# Altium schematic sheet power.SchDoc
size A4
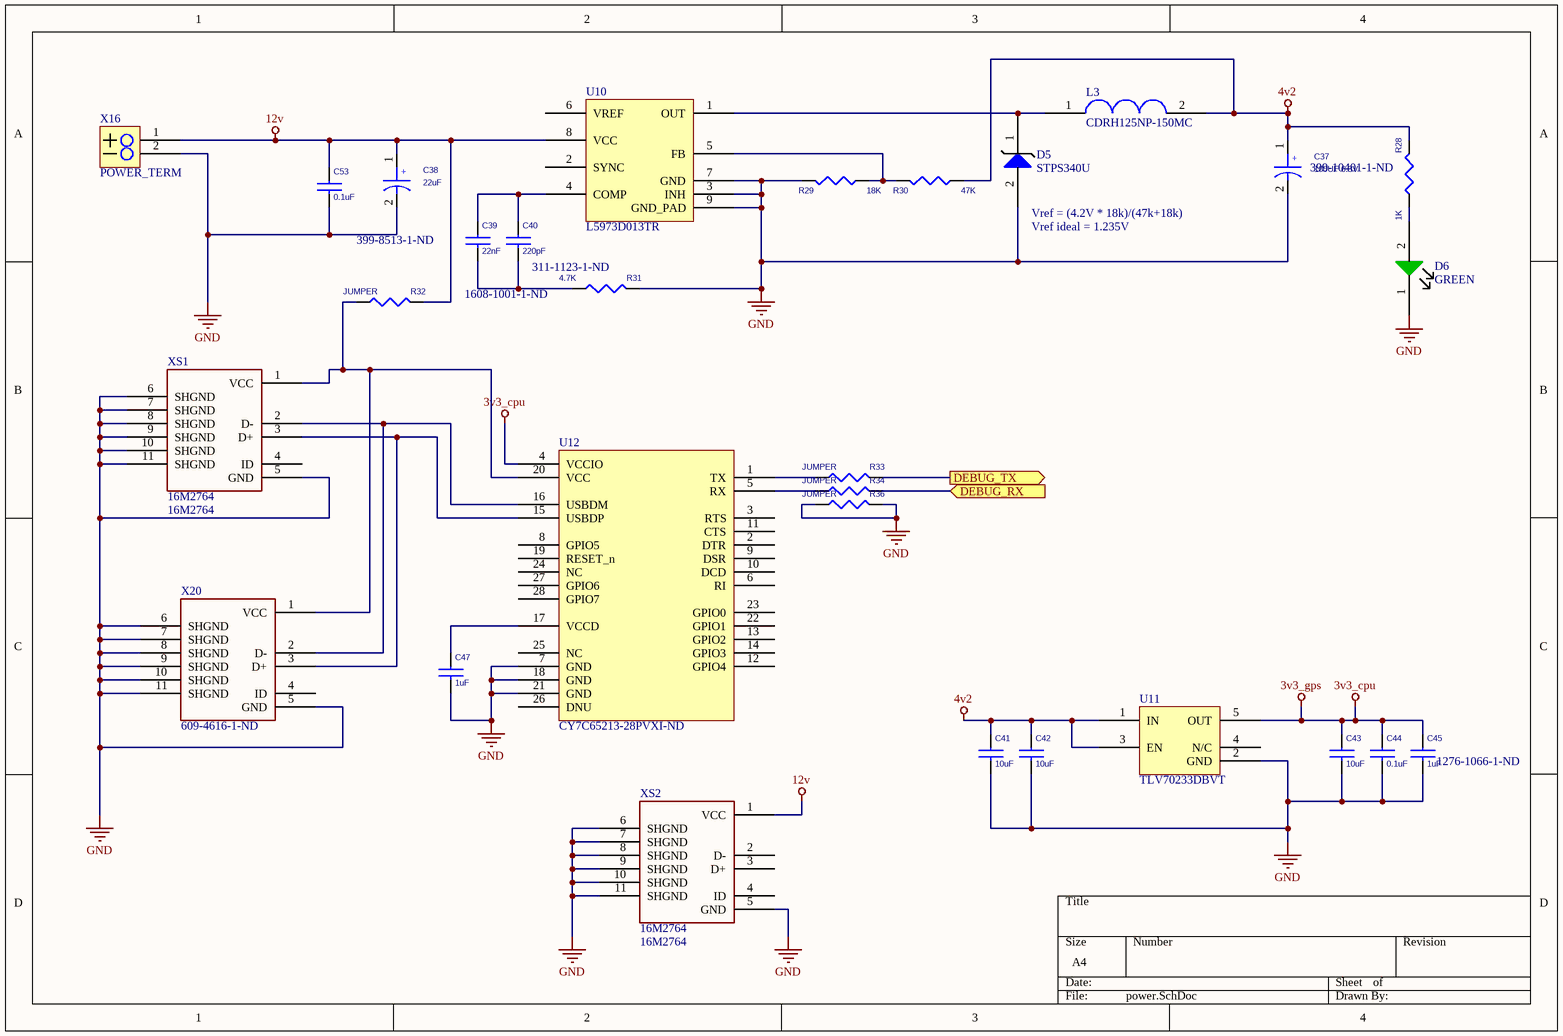
[diagram p0: power.SchDoc]

## Parts
C37  100UF 6.3V  Supplier Part Number 1: 399-10401-1-ND  [CAPMP6133X31N]
C38  22uF  Supplier Part Number 1: 399-8513-1-ND  [CAPMP7143X31N]
C39  22nF  Supplier Part Number 1: 1608-1001-1-ND  [CAPC2012X09M]
C40  220pF  Supplier Part Number 1: 311-1123-1-ND  [CAPC2012X09M]
C41  10uF  [CAPC2012X09M]
C42  10uF  [CAPC2012X09M]
C43  10uF  [CAPC2012X09M]
C44  0.1uF  [CAPC2012X09M]
C45  1uF  Supplier Part Number 1: 1276-1066-1-ND  [CAPC2012X09M]
C47  1uF  [CAPC2012X09M]
C53  0.1uF  [CAPC2012X09M]
D5  STPS340U  [SODFL535X265-2N]
D6  GREEN  [DIOC2012X11N]
L3  CDRH125NP-150MC  [INDP123123X40N_SUMIDA]
R28  1K  [RESC2013X06M]
R29  18K  [RESC2013X06M]
R30  47K  [RESC2013X06M]
R31  4.7K  [RESC2013X06M]
R32  JUMPER  [RESC2013X06M_CMEASURE]
R33  JUMPER  [RESC2013X06M_CMEASURE]
R34  JUMPER  [RESC2013X06M_CMEASURE]
R36  JUMPER  [RESC2013X06M_CMEASURE]
U10  L5973D013TR  [SOIC127P600X175_HS-9N]
U11  TLV70233DBVT  [SOT95P280X145-5M]
U12  Supplier Part Number 1: CY7C65213-28PVXI-ND  [SOP65P780X200-28M]  (hidden comment: CY7C65213)
X16  POWER_TERM  [PH5]
X20  Supplier Part Number 1: 609-4616-1-ND  [USB_MICRO_10118193]  (hidden comment: 10118193-0001LF)
XS1  16M2764  [USB_MINI_16M2764]
XS2  16M2764  [USB_MINI_16M2764]

## Ports
DEBUG_RX (in), DEBUG_TX (out)

## Nets
3v3_cpu: C43.1 C44.1 C45.1 U11.5(OUT) U12.4(VCCIO)  [also labelled 3v3_gps]
4v2: C37.1 C41.1 C42.1 L3.2 R28.2 R30.1 U11.1(IN) U11.3(EN)
12v: C38.1 C53.1 R32.2 U10.8(VCC) X16.1 XS2.1(VCC)
GND: C37.2 C38.2 C41.2 C42.2 C43.2 C44.2 C45.2 C47.2 C53.2 D5.2(A) D6.1(C) R29.2 R31.2 R36.1 R36.2 U10.3(INH) U10.7(GND) U10.9(GND_PAD) U11.2(GND) U12.7(GND) U12.18(GND) U12.21(GND) X16.2 X20.5(GND) X20.6(SHGND) X20.7(SHGND) X20.8(SHGND) X20.9(SHGND) X20.10(SHGND) X20.11(SHGND) XS1.5(GND) XS1.6(SHGND) XS1.7(SHGND) XS1.8(SHGND) XS1.9(SHGND) XS1.10(SHGND) XS1.11(SHGND) XS2.5(GND) XS2.6(SHGND) XS2.7(SHGND) XS2.8(SHGND) XS2.9(SHGND) XS2.10(SHGND) XS2.11(SHGND)
DEBUG_RX: R34.2 ; port DEBUG_RX
DEBUG_TX: R33.2 ; port DEBUG_TX
NetC39_1: C39.1 C40.1 U10.4(COMP)
NetC39_2: C39.2 C40.2 R31.1
NetC47_1: C47.1 U12.17(VCCD)
NetD5_1: D5.1(C) L3.1 U10.1(OUT)
NetD6_2: D6.2(A) R28.1
NetR29_1: R29.1 R30.2 U10.5(FB)
NetR32_1: R32.1 U12.20(VCC) X20.1(VCC) XS1.1(VCC)
NetR33_1: R33.1 U12.1(TX)
NetR34_1: R34.1 U12.5(RX)
NetU12_15: U12.15(USBDP) X20.3(D+) XS1.3(D+)
NetU12_16: U12.16(USBDM) X20.2(D-) XS1.2(D-)

Not connected (* = marked no-connect by the designer): U10 2(SYNC) 6(VREF); U11 4(N/C); U12 2(DTR) 3(RTS) 6(RI) 8(GPIO5) 9(DSR) 10(DCD) 11(CTS) 12(GPIO4) 13(GPIO2) 14(GPIO3) 19(RESET_n) 22(GPIO1) 23(GPIO0) 24(NC) 25(NC) 26(DNU) 27(GPIO6) 28(GPIO7); X20 4(ID); XS1 4(ID); XS2 2(D-) 3(D+) 4(ID)

## Notes on the sheet
- (near D5) Vref = (4.2V * 18k)/(47k+18k)
- Vref ideal = 1.235V
- (in symbol CAP_SMD_22UF_10%) +
- (in symbol CAP_SMD_100UF_10%) +

## Library data of the parts
C37 = CAP_SMD_100UF_10%: CAP 100uF; 6.3V; Case: C; ESR:150mOhm; Supplier 1: Digi-Key
C38 = CAP_SMD_22UF_10%: CAP SMD 35volts 22uF 10% ESR=300mOhms; Supplier 1: Digi-Key
C39 = CAP_SMD_22nF_10%: CAP 22NF 50V 10% X7R 0805; Value: 22nF; Supplier 1: Digi-Key
C40 = CAP_SMD_220pF_10%: CAP 220PF 50V 10%  0805; Value: 220pF; Supplier 1: Digi-Key
C41-C43 = CAP_SMD_10UF_20%: CAP CER 10UF 16V 20% X5R 0805; Value: 10uF; Supplier 1: Digi-Key; Supplier Part Number 1: 399-8013-1-ND
C44 C53 = CAP_SMD_0.1UF_10%: CAP CER 0.1UF 25V 10% X7R 0805; Value: 0.1uF; Supplier 1: Digi-Key; Supplier Part Number 1: 399-1168-6-ND
C45 C47 = CAP_SMD_1uF_10%: MLCC; 1uF; 25V; X7R; ±10%; SMD; 0805;; Value: 1uF; Supplier 1: Digi-Key
  C47: Supplier Part Number 1: 1276-1066-1-ND
D5 = STPS340U: DIODE, ZENER, 20V, 3W; Supplier 1: Digi-Key; Supplier Part Number 1: 497-13432-1-ND
D6 = LED_GREEN: Supplier 1: Digi-Key; Supplier Part Number 1: 160-1179-2-ND
L3 = IND_15uH_3.3A: Supplier 1: Digi-Key; Supplier Part Number 1: 308-1440-1-ND
R28 = RES_SMD_1K_5%: RES - 1K OHM, 5%, 1/8W, 0805 SMD; Supplier 1: Digi-Key; Supplier Part Number 1: P1.0KADKR-ND
R29 = RES_SMD_18K_1%: RES 18K OHM 1/8W 1% 0805 SMD; Supplier 1: Digi-Key; Supplier Part Number 1: P18.0KCCT-ND
R30 = RES_SMD_47K_1%: RES 47K OHM 1/8W 1% 0805; Supplier 1: Digi-Key; Supplier Part Number 1: 1276-5377-2-ND
R31 = RES_SMD_4.7K_1%: RES 4.7K OHM 1/8W 1% 0805 SMD; Supplier 1: Digi-Key; Supplier Part Number 1: RMCF0805FT4K70CT-ND
R32-R34 R36 = RES_SMD_0_CURRENT: RES 0.0 OHM 1/8W JUMP 0805 SMD; Supplier 1: Digi-Key; Supplier Part Number 1: P0.0ATR-ND
U10 = L5973D013TR: IC REG BUCK ADJ 2.5A SOIC8; Supplier 1: Digi-Key; Supplier Part Number 1: 497-14766-5-ND
X20 = USB_MICRO: Supplier 1: Digi-Key
XS1 XS2 = USB_MINI_16M2764: Supplier 1: Newark; Supplier Part Number 1: 16M2764
U11 = TLV70233DBVT: Supplier 1: Digi-Key; Supplier Part Number 1: 296-32415-1-ND
U12 = CY7C65213: Supplier 1: Digi-Key
X16 = POWER_TERM: Supplier 1: Newark; Supplier Part Number 1: 70R0063